# EAGLE design PwrGenBrd_v4.2 (EAGLE 7.6.0)

## Sheet 1 of 2
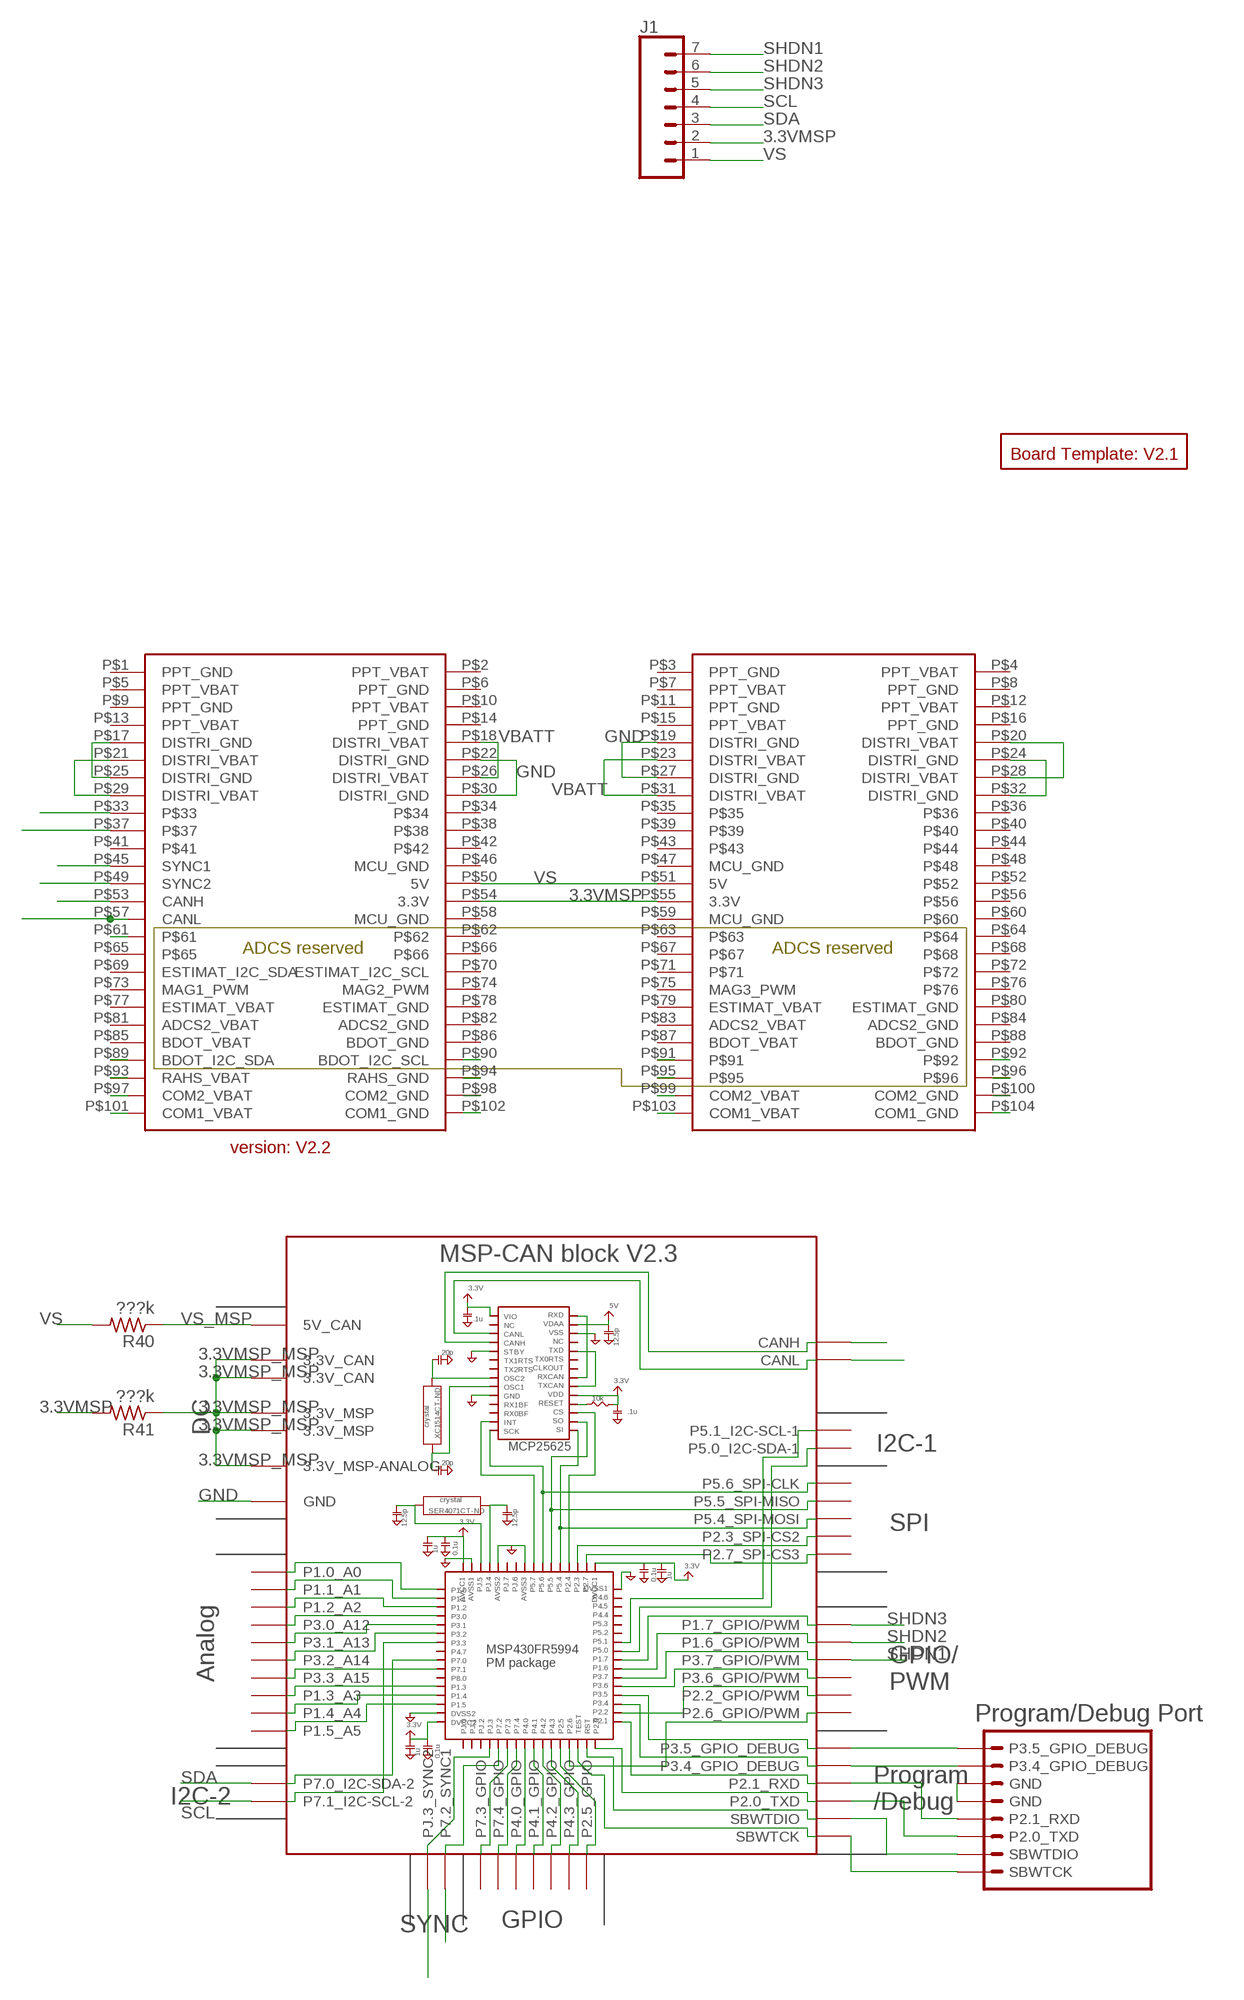
[diagram p0: schematic, sheet 1, part 1 of 2]
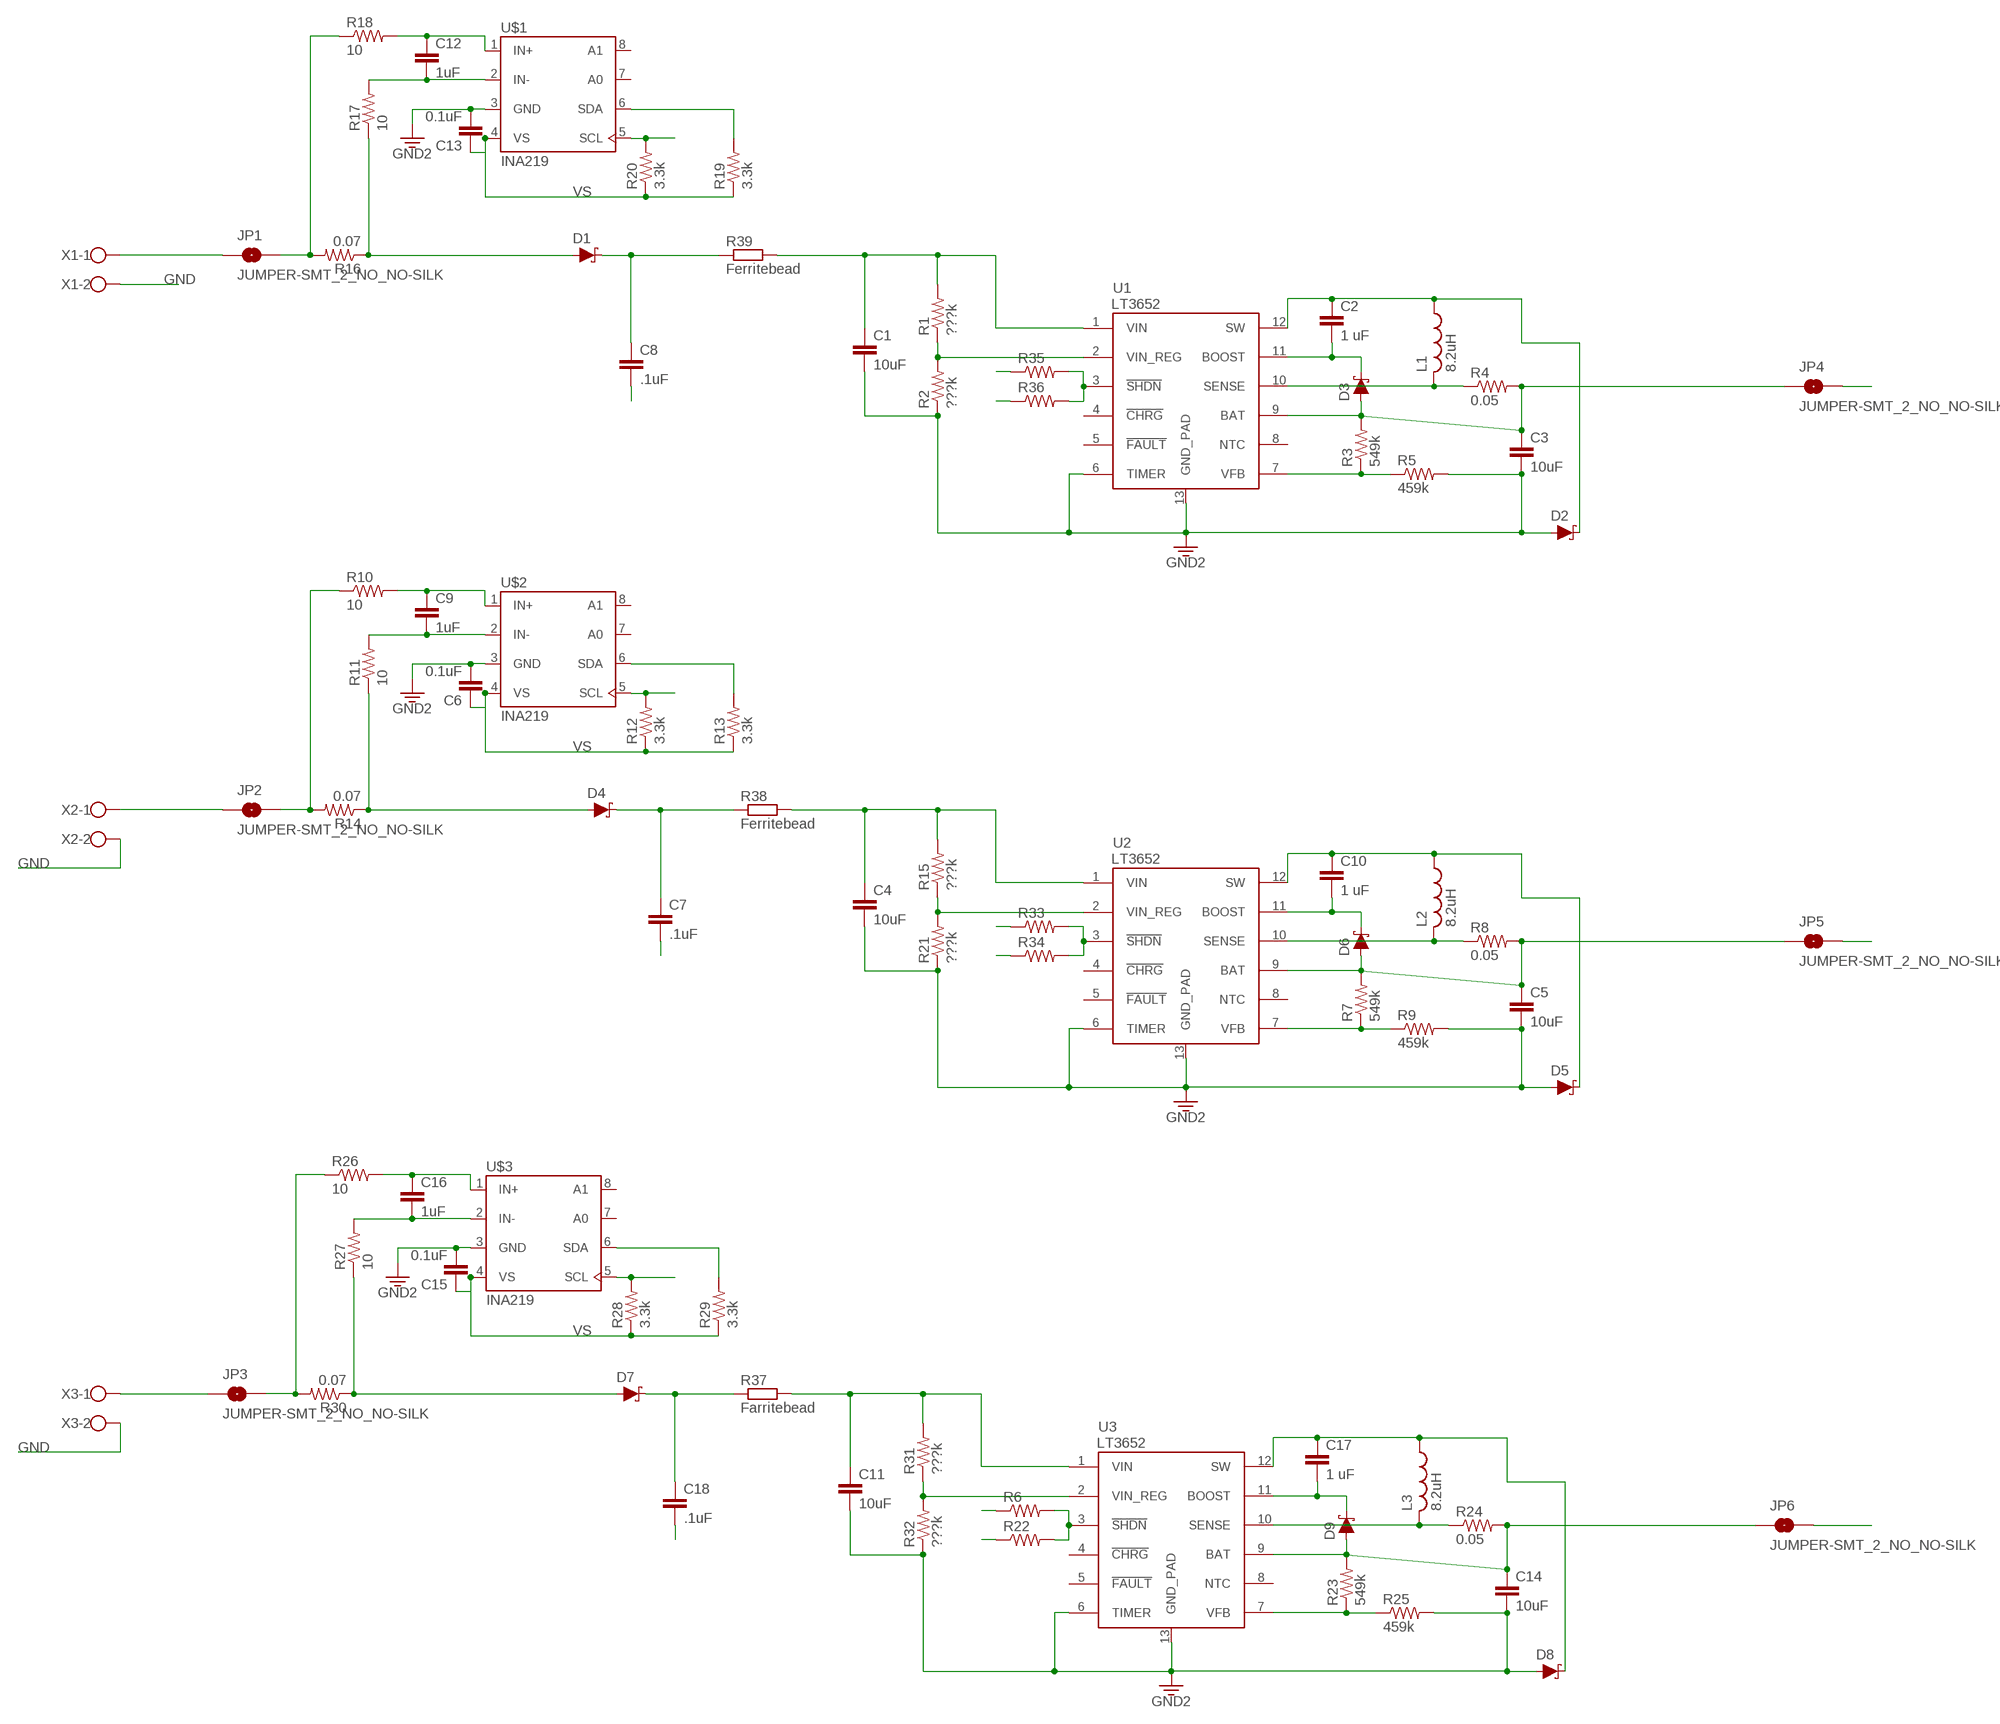
[diagram p1: schematic, sheet 1, part 2 of 2]

### Parts
C1  10uF  10UF-1210-50V-20%  [1210]
C2  1 uF  C-EUC0805  [C0805]
C3  10uF  C-EUC0805  [C0805]
C4  10uF  10UF-1210-50V-20%  [1210]
C5  10uF  C-EUC0805  [C0805]
C6  0.1uF  C-EUC0805  [C0805]
C7  .1uF  C-EUC0805  [C0805]
C8  .1uF  C-EUC0805  [C0805]
C9  1uF  C-EUC0805  [C0805]
C10  1 uF  C-EUC0805  [C0805]
C11  10uF  10UF-1210-50V-20%  [1210]
C12  1uF  C-EUC0805  [C0805]
C13  0.1uF  C-EUC0805  [C0805]
C14  10uF  C-EUC0805  [C0805]
C15  0.1uF  C-EUC0805  [C0805]
C16  1uF  C-EUC0805  [C0805]
C17  1 uF  C-EUC0805  [C0805]
C18  .1uF  C-EUC0805  [C0805]
D1  DIODE-SCHOTTKY-B340A  [SMA-DIODE]
D2  DIODE-SCHOTTKY-B340A  [SMA-DIODE]
D3  DIODE-SCHOTTKY-ZLLS500  [SOT23-3]
D4  DIODE-SCHOTTKY-B340A  [SMA-DIODE]
D5  DIODE-SCHOTTKY-B340A  [SMA-DIODE]
D6  DIODE-SCHOTTKY-ZLLS500  [SOT23-3]
D7  DIODE-SCHOTTKY-B340A  [SMA-DIODE]
D8  DIODE-SCHOTTKY-B340A  [SMA-DIODE]
D9  DIODE-SCHOTTKY-ZLLS500  [SOT23-3]
J1  CONN_07LOCK_LONGPADS  [1X07_LOCK_LONGPADS]
JP1  JUMPER-SMT_2_NO_NO-SILK  [SMT-JUMPER_2_NO_NO-SILK]
JP2  JUMPER-SMT_2_NO_NO-SILK  [SMT-JUMPER_2_NO_NO-SILK]
JP3  JUMPER-SMT_2_NO_NO-SILK  [SMT-JUMPER_2_NO_NO-SILK]
JP4  JUMPER-SMT_2_NO_NO-SILK  [SMT-JUMPER_2_NO_NO-SILK]
JP5  JUMPER-SMT_2_NO_NO-SILK  [SMT-JUMPER_2_NO_NO-SILK]
JP6  JUMPER-SMT_2_NO_NO-SILK  [SMT-JUMPER_2_NO_NO-SILK]
L1  8.2uH  L-USL1812  [L1812]
L2  8.2uH  L-USL1812  [L1812]
L3  8.2uH  L-USL1812  [L1812]
R1  ???k  R-US_R0805  [R0805]
R2  ???k  R-US_R0805  [R0805]
R3  549k  R-US_R0805  [R0805]
R4  0.05  R-US_R0805  [R0805]
R5  459k  R-US_R0805  [R0805]
R6  R-US_R0805  [R0805]
R7  549k  R-US_R0805  [R0805]
R8  0.05  R-US_R0805  [R0805]
R9  459k  R-US_R0805  [R0805]
R10  10  R-US_R0805  [R0805]
R11  10  R-US_R0805  [R0805]
R12  3.3k  R-US_R0805  [R0805]
R13  3.3k  R-US_R0805  [R0805]
R14  0.07  R-US_R0805  [R0805]
R15  ???k  R-US_R0805  [R0805]
R16  0.07  R-US_R0805  [R0805]
R17  10  R-US_R0805  [R0805]
R18  10  R-US_R0805  [R0805]
R19  3.3k  R-US_R0805  [R0805]
R20  3.3k  R-US_R0805  [R0805]
R21  ???k  R-US_R0805  [R0805]
R22  R-US_R0805  [R0805]
R23  549k  R-US_R0805  [R0805]
R24  0.05  R-US_R0805  [R0805]
R25  459k  R-US_R0805  [R0805]
R26  10  R-US_R0805  [R0805]
R27  10  R-US_R0805  [R0805]
R28  3.3k  R-US_R0805  [R0805]
R29  3.3k  R-US_R0805  [R0805]
R30  0.07  R-US_R0805  [R0805]
R31  ???k  R-US_R0805  [R0805]
R32  ???k  R-US_R0805  [R0805]
R33  R-US_R0805  [R0805]
R34  R-US_R0805  [R0805]
R35  R-US_R0805  [R0805]
R36  R-US_R0805  [R0805]
R37  Farritebead  R-EU_R1206  [R1206]
R38  Ferritebead  R-EU_R1206  [R1206]
R39  Ferritebead  R-EU_R1206  [R1206]
R40  ???k  R-US_R0805  [R0805]
R41  ???k  R-US_R0805  [R0805]
U1  LT3652  [MSOP-12_GND]
U2  LT3652  [MSOP-12_GND]
U3  LT3652  [MSOP-12_GND]
U$1  INA219  [SO08]
U$2  INA219  [SO08]
U$3  INA219  [SO08]
U$4  PC104_CONNECTOR  [PC104_CONNECTOR]
U$5  MSP-CAN_BLOCK  [MSP-CAN_BLOCK]
U$6  BOARD_TEMPLATE_(V2.1)  [BOARD_TEMPLATE_(V2.1)]
U$8  PROGRAM/DEBUG_PORT  [1X08_CONNECTOR]
X1  W237-102  [W237-102]
X2  W237-102  [W237-102]
X3  W237-102  [W237-102]

### Nets
3.3VMSP: J1.2 R41.2 U$4.P$54(3.3V) U$4.P$55(3.3V)
3.3VMSP_MSP: R41.1 U$5.3.3V@CAN1(3.3V_CAN) U$5.3.3V@CAN2(3.3V_CAN) U$5.3.3V@MSP1(3.3V_MSP) U$5.3.3V@MSP2(3.3V_MSP) U$5.3.3V_ANALOG@MSP2(3.3V_MSP-ANALOG)
BATT: C3.1 D3.1(A) JP4.1 R3.2 R4.2 U1.9(BAT)
BATT1: C5.1 D6.1(A) JP5.1 R7.2 R8.2 U2.9(BAT)
BATT2: C14.1 D9.1(A) JP6.1 R23.2 R24.2 U3.9(BAT)
BOOST: C2.2 D3.3(C) U1.11(BOOST)
BOOST1: C10.2 D6.3(C) U2.11(BOOST)
BOOST2: C17.2 D9.3(C) U3.11(BOOST)
CANH: U$4.P$53(CANH) U$5.CANH
CANL: U$4.P$57(CANL) U$5.CANL
GND: C1.2 C3.2 C4.2 C5.2 C6.2 C7.2 C8.2 C11.2 C13.2 C14.2 C15.2 C18.2 D2.A D5.A D8.A R2.1 R5.2 R9.2 R21.1 R25.2 R32.1 U1.6(TIMER) U1.13(GND_PAD) U2.6(TIMER) U2.13(GND_PAD) U3.6(TIMER) U3.13(GND_PAD) U$1.3(GND) U$2.3(GND) U$3.3(GND) U$4.P$17(DISTRI_GND) U$4.P$19(DISTRI_GND) U$4.P$22(DISTRI_GND) U$4.P$24(DISTRI_GND) U$4.P$25(DISTRI_GND) U$4.P$27(DISTRI_GND) U$4.P$30(DISTRI_GND) U$4.P$32(DISTRI_GND) U$5.GND@1(GND) U$5.GND@2(GND) U$5.GND@3(GND) U$5.GND@4(GND) U$5.GND@5(GND) U$5.GND@7(GND) U$5.GND@8(GND) U$5.GND@9(GND) U$5.GND@10(GND) U$5.GND@11(GND) U$5.GND@12(GND) U$5.GND@13(GND) U$5.GND@14(GND) U$5.GND@15(GND) U$5.GND@16(GND) U$5.GND@17(GND) U$5.GND@26(GND) U$8.5(GND) U$8.6(GND) X1.2 X2.2 X3.2 ; supply symbol labelled GND2
IN+: C12.1 R18.2 U$1.1(IN+)
IN+1: C9.1 R10.2 U$2.1(IN+)
IN+2: C16.1 R26.2 U$3.1(IN+)
IN++: JP1.2 R16.2 R18.1
IN++1: JP2.2 R10.1 R14.2
IN++2: JP3.2 R26.1 R30.2
IN-: C12.2 R17.2 U$1.2(IN-)
IN-1: C9.2 R11.2 U$2.2(IN-)
IN-2: C16.2 R27.2 U$3.2(IN-)
IN--: D1.A R16.1 R17.1
IN--1: D4.A R11.1 R14.1
IN--2: D7.A R27.1 R30.1
N$2: R6.2 R22.2 U3.3(!SHDN)
N$3: U$4.P$101(COM1_VBAT)
N$4: U$4.P$97(COM2_VBAT)
N$5: U$4.P$93(RAHS_VBAT)
N$6: U$4.P$89(BDOT_I2C_SDA)
N$8: U$4.P$61
N$9: U$4.P$90(BDOT_I2C_SCL)
N$10: U$4.P$98(COM2_GND)
N$11: U$4.P$103(COM1_VBAT)
N$12: U$4.P$102(COM1_GND)
N$13: U$4.P$94(RAHS_GND)
N$14: U$4.P$99(COM2_VBAT)
N$15: U$4.P$91
N$16: U$4.P$95
N$17: U$4.P$92
N$18: U$4.P$96
N$19: U$4.P$100(COM2_GND)
N$20: U$4.P$104(COM1_GND)
N$21: C8.1 D1.C R39.1
N$22: C7.1 D4.C R38.1
N$23: R33.2 R34.2 U2.3(!SHDN)
N$24: C18.1 D7.C R37.1
N$26: R35.2 R36.2 U1.3(!SHDN)
P2.0TXD: U$5.P2.0_TXD U$8.3(P2.0_TXD)
P2.1RXD: U$5.P2.1_RXD U$8.4(P2.1_RXD)
P3.4GPIO: U$5.P3.4_GPIO_DEBUG U$8.7(P3.4_GPIO_DEBUG)
P3.5GPIO: U$5.P3.5_GPIO_DEBUG U$8.8(P3.5_GPIO_DEBUG)
PNL1: JP1.1 R35.1 X1.1
PNL2: JP2.1 R33.1 X2.1
PNL3: JP3.1 R6.1 X3.1
SBWTCK: U$5.SBWTCK U$8.SBWTCK
SBWTDIO: U$5.SBWTDIO U$8.2(SBWTDIO)
SCL: J1.4 R12.2 R20.2 R28.2 U$1.5(SCL) U$2.5(SCL) U$3.5(SCL) U$4.P$33 U$5.P7.1_I2C-SCL-2
SDA: J1.3 R13.2 R19.2 R29.2 U$1.6(SDA) U$2.6(SDA) U$3.6(SDA) U$4.P$37 U$5.P7.0_I2C-SDA-2
SENSE: L1.2 R4.1 U1.10(SENSE)
SENSE1: L2.2 R8.1 U2.10(SENSE)
SENSE2: L3.2 R24.1 U3.10(SENSE)
SHDN1: J1.7 R36.1 U$5.P3.7_GPIO/PWM
SHDN2: J1.6 R34.1 U$5.P1.6_GPIO/PWM
SHDN3: J1.5 R22.1 U$5.P1.7_GPIO/PWM
SW: C2.1 D2.C L1.1 U1.12(SW)
SW1: C10.1 D5.C L2.1 U2.12(SW)
SW2: C17.1 D8.C L3.1 U3.12(SW)
SYNC1: U$4.P$45(SYNC1) U$5.P7.2_SYNC1
SYNC2: U$4.P$49(SYNC2) U$5.PJ.3_SYNC2
VBATT: JP4.2 JP5.2 JP6.2 U$4.P$18(DISTRI_VBAT) U$4.P$20(DISTRI_VBAT) U$4.P$21(DISTRI_VBAT) U$4.P$23(DISTRI_VBAT) U$4.P$26(DISTRI_VBAT) U$4.P$28(DISTRI_VBAT) U$4.P$29(DISTRI_VBAT) U$4.P$31(DISTRI_VBAT)
VFB: R3.1 R5.1 U1.7(VFB)
VFB1: R7.1 R9.1 U2.7(VFB)
VFB2: R23.1 R25.1 U3.7(VFB)
VIN: C1.1 R1.2 R39.2 U1.1(VIN)
VIN1: C4.1 R15.2 R38.2 U2.1(VIN)
VIN2: C11.1 R31.2 R37.2 U3.1(VIN)
VIN_REG: R1.1 R2.2 U1.2(VIN_REG)
VIN_REG1: R15.1 R21.2 U2.2(VIN_REG)
VIN_REG2: R31.1 R32.2 U3.2(VIN_REG)
VS: C6.1 C13.1 C15.1 J1.1 R12.1 R13.1 R19.1 R20.1 R28.1 R29.1 R40.2 U$1.4(VS) U$2.4(VS) U$3.4(VS) U$4.P$50(5V) U$4.P$51(5V)
VS_MSP: R40.1 U$5.5V(5V_CAN)
Unconnected: U1.4(!CHRG) U1.5(!FAULT) U1.8(NTC) U2.4(!CHRG) U2.5(!FAULT) U2.8(NTC) U3.4(!CHRG) U3.5(!FAULT) U3.8(NTC) U$1.7(A0) U$1.8(A1) U$2.7(A0) U$2.8(A1) U$3.7(A0) U$3.8(A1) U$4.P$1(PPT_GND) U$4.P$2(PPT_VBAT) U$4.P$3(PPT_GND) U$4.P$4(PPT_VBAT) U$4.P$5(PPT_VBAT) U$4.P$6(PPT_GND) U$4.P$7(PPT_VBAT) U$4.P$8(PPT_GND) U$4.P$9(PPT_GND) U$4.P$10(PPT_VBAT) U$4.P$11(PPT_GND) U$4.P$12(PPT_VBAT) U$4.P$13(PPT_VBAT) U$4.P$14(PPT_GND) U$4.P$15(PPT_VBAT) U$4.P$16(PPT_GND) U$4.P$34 U$4.P$35 U$4.P$36 U$4.P$38 U$4.P$39 U$4.P$40 U$4.P$41 U$4.P$42 U$4.P$43 U$4.P$44 U$4.P$46(MCU_GND) U$4.P$47(MCU_GND) U$4.P$48 U$4.P$52 U$4.P$56 U$4.P$58(MCU_GND) U$4.P$59(MCU_GND) U$4.P$60 U$4.P$62 U$4.P$63 U$4.P$64 U$4.P$65 U$4.P$66 U$4.P$67 U$4.P$68 U$4.P$69(ESTIMAT_I2C_SDA) U$4.P$70(ESTIMAT_I2C_SCL) U$4.P$71 U$4.P$72 U$4.P$73(MAG1_PWM) U$4.P$74(MAG2_PWM) U$4.P$75(MAG3_PWM) U$4.P$76 U$4.P$77(ESTIMAT_VBAT) U$4.P$78(ESTIMAT_GND) U$4.P$79(ESTIMAT_VBAT) U$4.P$80(ESTIMAT_GND) U$4.P$81(ADCS2_VBAT) U$4.P$82(ADCS2_GND) U$4.P$83(ADCS2_VBAT) U$4.P$84(ADCS2_GND) U$4.P$85(BDOT_VBAT) U$4.P$86(BDOT_GND) U$4.P$87(BDOT_VBAT) U$4.P$88(BDOT_GND) U$5.P1.0_A0 U$5.P1.1_A1 U$5.P1.2_A2 U$5.P1.3_A3 U$5.P1.4_A4 U$5.P1.5_A5 U$5.P2.2_GPIO/PWM U$5.P2.4_SPI-CS2(P2.3_SPI-CS2) U$5.P2.5_GPIO U$5.P2.6_GPIO/PWM U$5.P2.7_SPI-CS3 U$5.P3.0_A12 U$5.P3.1_A13 U$5.P3.2_A14 U$5.P3.3_A15 U$5.P3.6_GPIO/PWM U$5.P4.0_GPIO U$5.P4.1_GPIO U$5.P4.2_GPIO U$5.P4.3_GPIO U$5.P5.0_I2C-SDA-1 U$5.P5.1_I2C-SCL-1 U$5.P5.4_SPI-MOSI U$5.P5.5_SPI-MISO U$5.P5.6_SPI-CLK U$5.P7.3_GPIO U$5.P7.4_GPIO

## Sheet 2 of 2

## Library data of the parts
C1 C4 C11 = SparkFun-Capacitors:10UF: 10.0µF ceramic capacitors A capacitor is a passive two-terminal electrical component used to store electrical energy temporarily in an electric field.; PROD_ID: CAP-09824
C2 C7 C8 C10 C17 C18 = rcl:C-EU: CAPACITOR, European symbol
C3 C5 C6 C9 C12-C16 = resistor:C-EU: CAPACITOR, European symbol
D1 D2 D4 D5 D7 D8 = SparkFun-DiscreteSemi:DIODE-SCHOTTKY: Schottky diode A Schottky diode is a semiconductor diode which has a low forward voltage drop and a very fast switching action.; PROD_ID: DIO-09886; VALUE: 3A/40V/500mV
D3 D6 D9 = SparkFun-DiscreteSemi:DIODE-SCHOTTKY: Schottky diode A Schottky diode is a semiconductor diode which has a low forward voltage drop and a very fast switching action.; PROD_ID: DIO-08411; VALUE: 700mA/40V/533mV
J1 = SparkFun-Connectors:CONN_07: Multi connection point. Often used as Generic Header-pin footprint for 0.1 inch spaced/style header connections On any of the 0.1 inch spaced packages, you can populate with these: Break Away Headers - Straight <https://www.sparkfun.com/products/116> (PRT-00116) Break Away Male Headers - Right Angle <https://www.sparkfun.com/products/553> (PRT-00553) Female Headers <https://www.sparkfun.com/products/115> (PRT-00115) Break Away Headers - Machine Pin <https://www.sparkfun.com/products/117> (PRT-00117) Break Away Female Headers - Swiss Machine Pin <https://www.sparkfun.com/products/743> (PRT-00743) For SCREWTERMINALS and SPRING TERMINALS visit here: Screw Terimnals on SparkFun.com <https://www.sparkfun.com/search/results?term=Screw+Terminals> (5mm/3.5mm/2.54mm spacing) This device is also useful as a general connection point to wire up your design to another part of your project. Our various solder wires solder well into these plated through hole pads. Hook-Up Wire - Assortment (Stranded, 22 AWG) <https://www.sparkfun.com/products/11375> (PRT-11375) Hook-Up Wire - Assortment (Solid Core, 22 AWG) <https://www.sparkfun.com/products/11367> (PRT-11367) View the entire wire category on our website here <https://www.sparkfun.com/categories/141> Special notes: Molex polarized connector foot print use with SKU : PRT-08231 with associated crimp pins and housings. 1MM SMD Version SKU: PRT-10208 NOTES ON THE VARIANTS LOCK and LOCK_LONGPADS... This footprint was designed to help hold the alignment of a through-hole component (i.e. 6-pin header) while soldering it into place. You may notice that each hole has been shifted either up or down by 0.005 of an inch from it's more standard position (which is a perfectly straight line). This slight alteration caused the pins (the squares in the middle) to touch the edges of the holes. Because they are alternating, it causes a "brace" to hold the component in place. 0.005 has proven to be the perfect amount of "off-center" position when using our standard breakaway headers. Although looks a little odd when you look at the bare footprint, once you have a header in there, the alteration is very hard to notice. Also,if you push a header all the way into place, it is covered up entirely on the bottom side.
JP1-JP6 = SparkFun-Jumpers:JUMPER-SMT_2_NO: Normally open jumper This jumper has two pads in close proximity to each other. Apply solder to close the connection. Round pads are easier to solder for beginners, but are a lot larger. SparkFun Product that uses the round pads: SparkFun EL Sequencer <https://www.sparkfun.com/products/12781>
L1-L3 = rcl:L-US: INDUCTOR, American symbol
R1-R36 R40 R41 = rcl:R-US_: RESISTOR, American symbol
R37-R39 = rcl:R-EU_: RESISTOR, European symbol
U1-U3 = SparkFun-IC-Power:LT3652: LT3652 MPPT Solar Charge Controller(IC-11822) 5V-32V smart charger for batteries up to 14.4V
U$1-U$3 = User-Submitted:INA219
U$4 = CubeSat(V2.4):PC104_CONNECTOR
U$5 = CubeSat(V2.4):MSP-CAN_BLOCK
U$6 = CubeSat(V2.2):BOARD_TEMPLATE_(V2.1)
U$8 = CubeSat(V2.4):PROGRAM/DEBUG_PORT
X1-X3 = con-wago-500:W237-102: WAGO SCREW CLAMP; MPN: 237-102; OC_FARNELL: unknown; OC_NEWARK: 70K9898

## Board
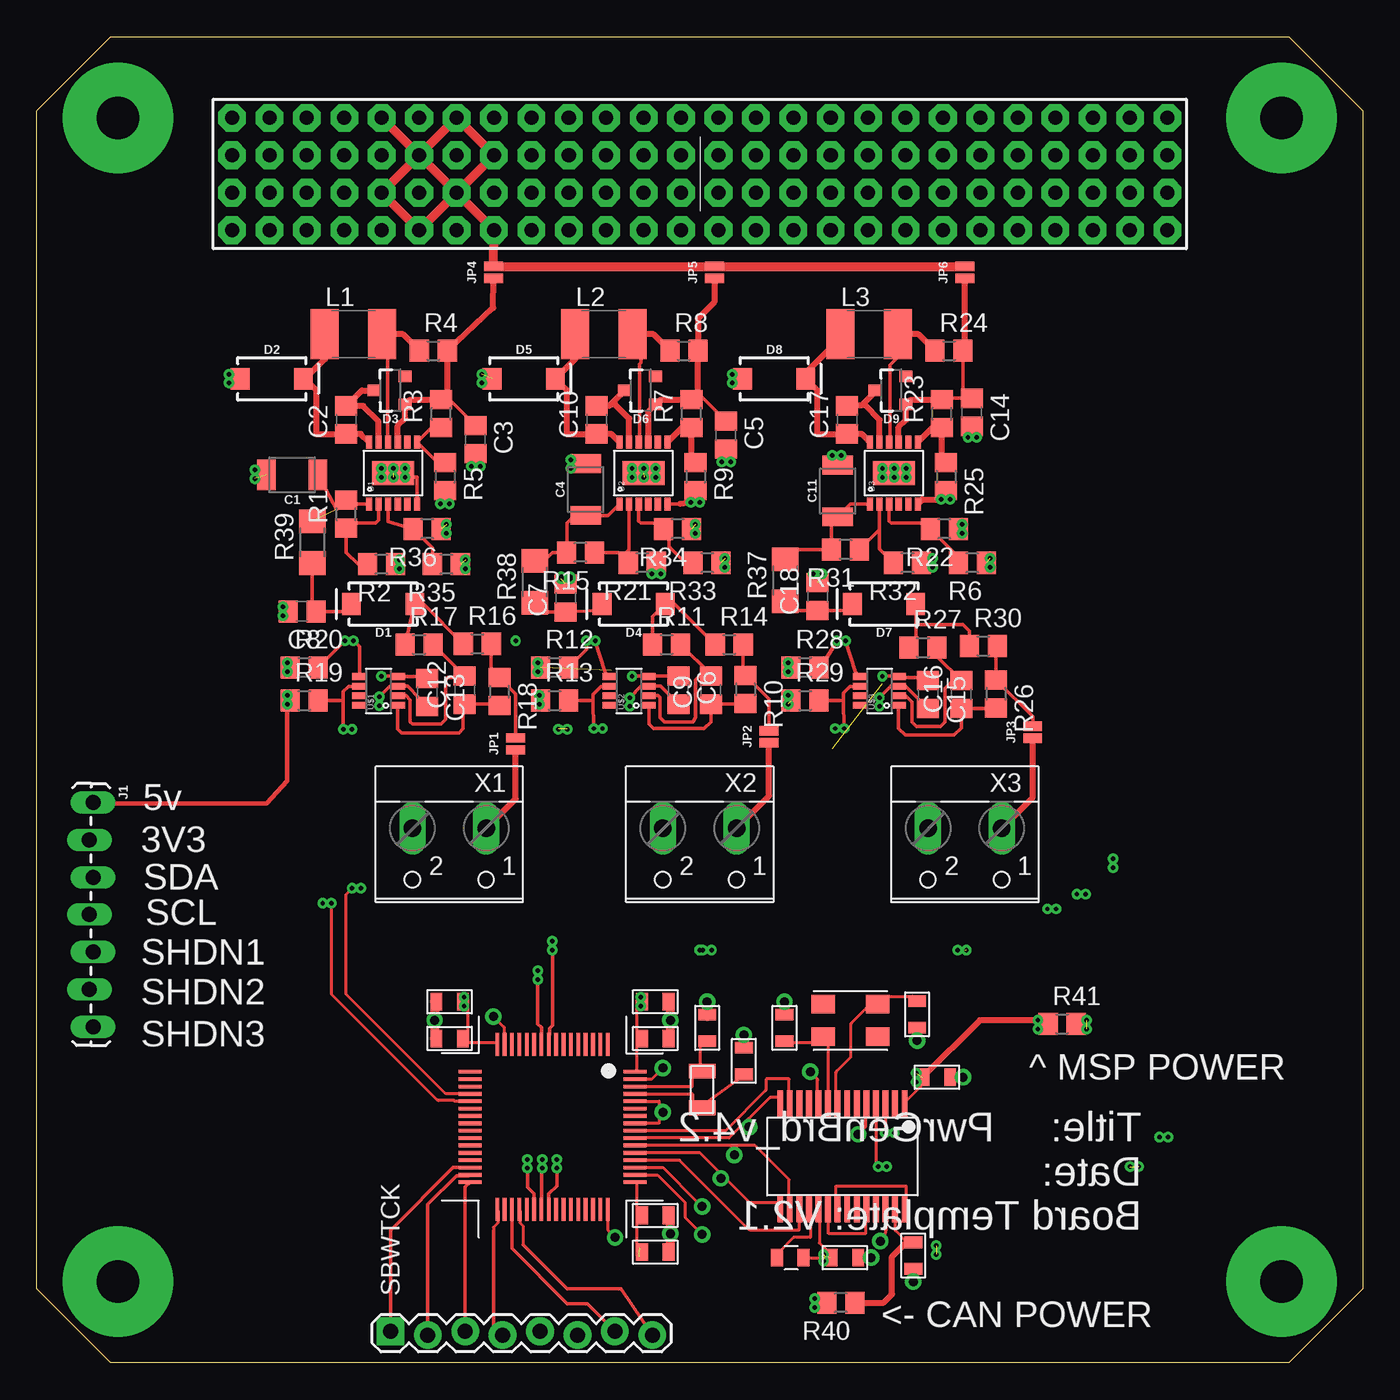
[diagram p2: board, top side]
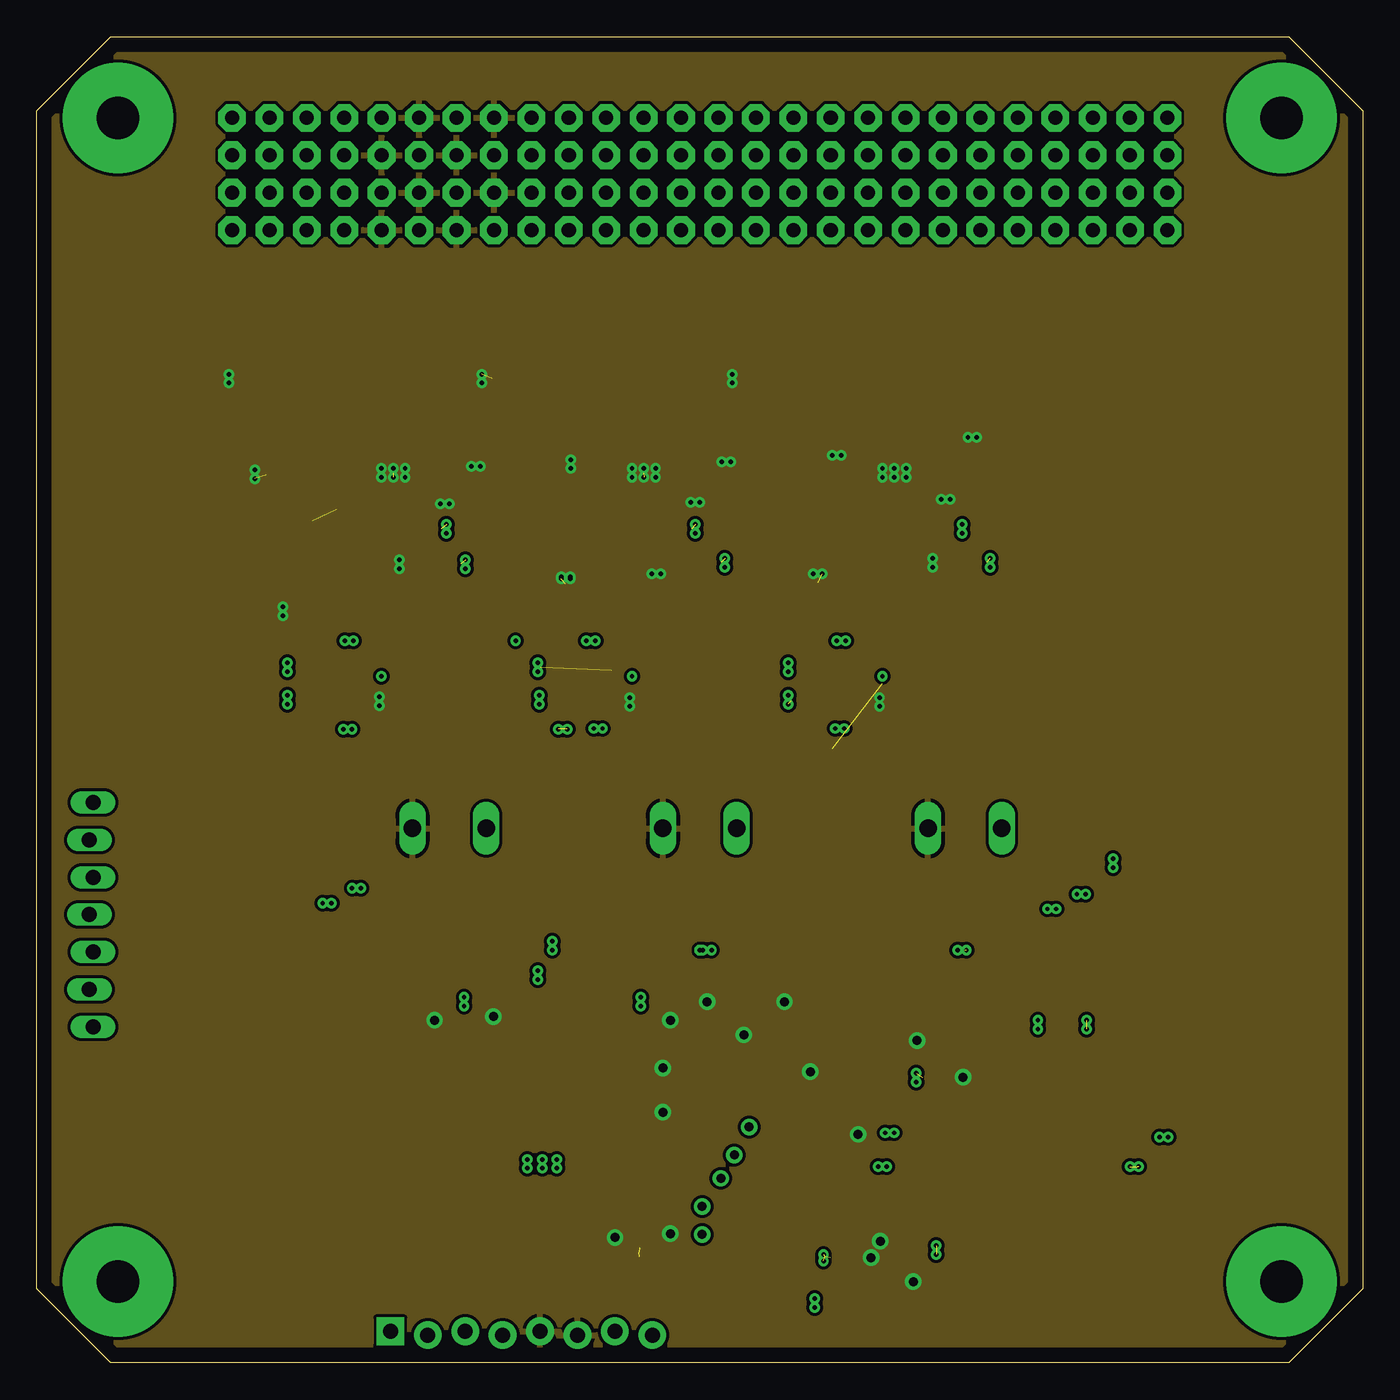
[diagram p3: board, inner layer GND]
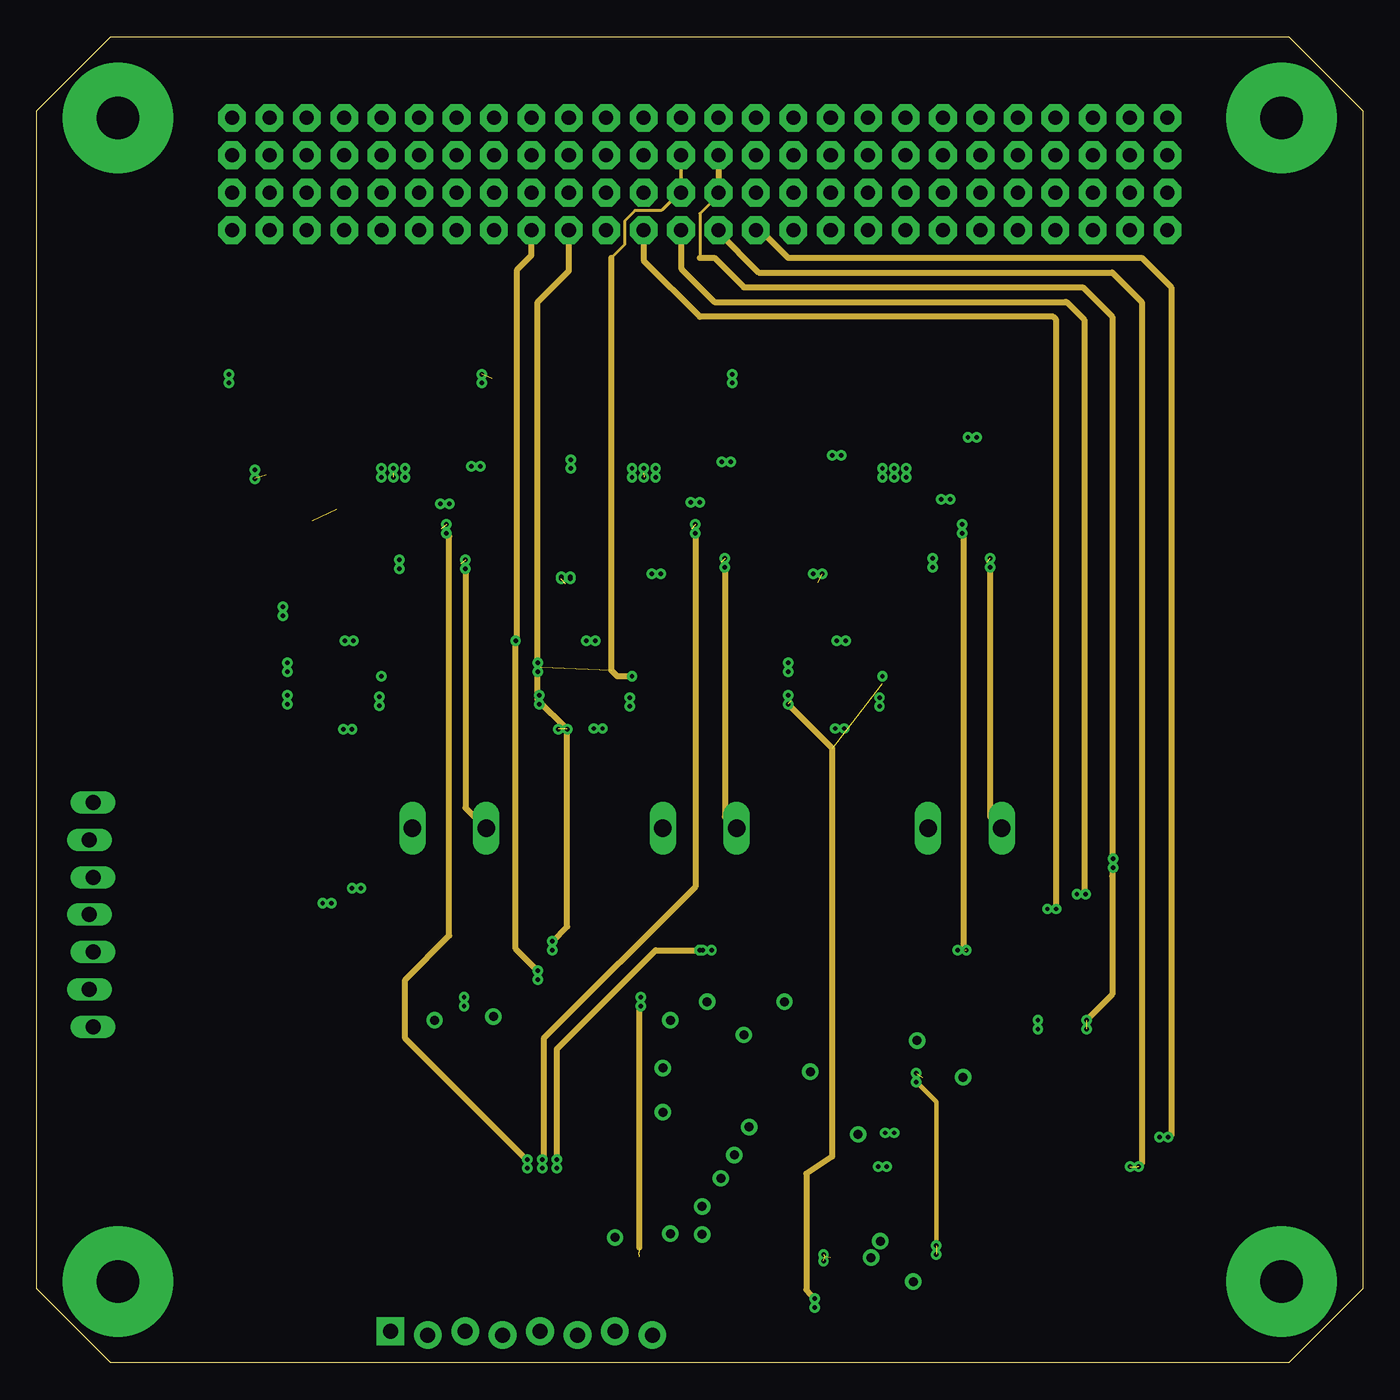
[diagram p4: board, inner layer TBD]
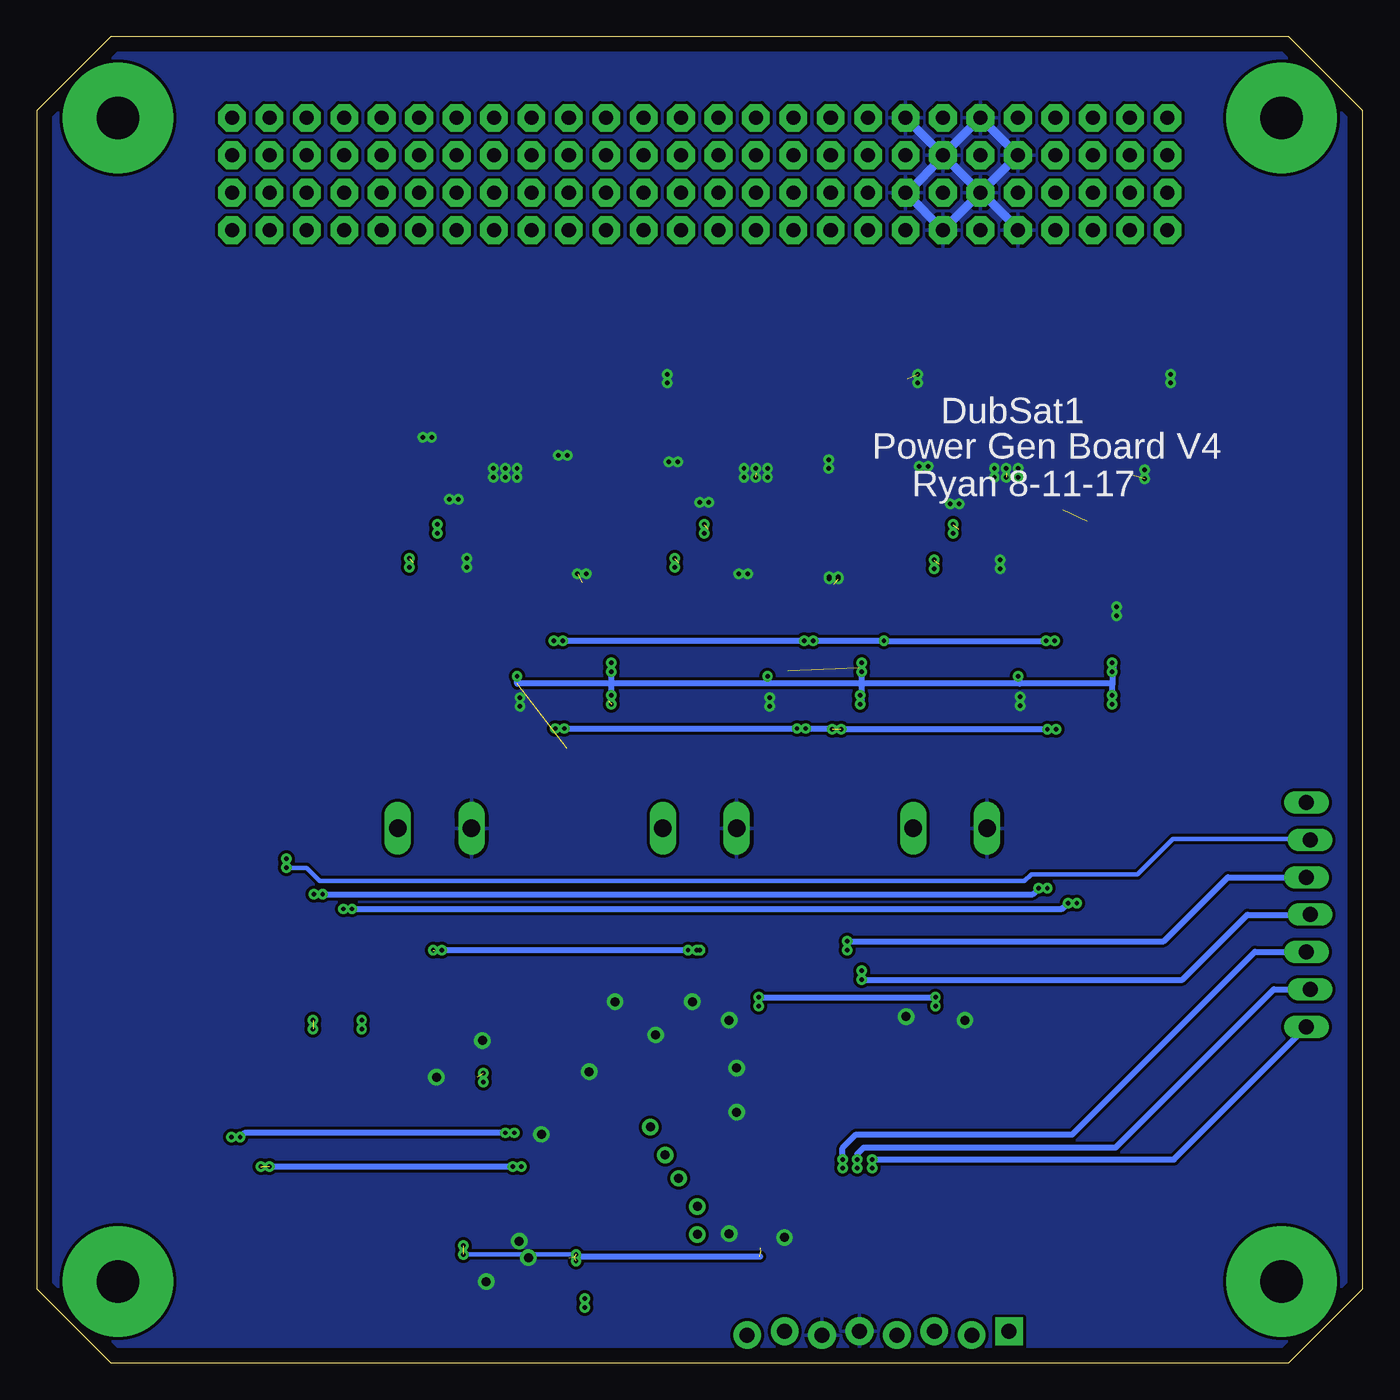
[diagram p5: board, bottom side, seen from below]

Size 90 x 90 mm. Coordinates in mm from the lower left corner, seen from the top.
Copper layers (1*2*3*16): Top 0.035mm / dielectric 1.5mm / GND 0.035mm / dielectric 0.15mm / TBD 0.035mm / dielectric 0.2mm / Bottom 0.035mm
Design rules "default *": minimum track width 10mil, minimum drill 24mil, track to track 8mil, track to pad 8mil, pad to pad 8mil, via to via 8mil, smd to smd 8mil, copper to edge 40mil, drill to drill 8mil, minimum pad ring 10mil, minimum via ring 8mil, stop-mask expansion 4mil, vias tented up to drill 0mil, thermal gap 10mil

### Footprints (pad centres in the part's own frame; a part is rotated, then mirrored left to right if it is on the bottom)
1210 = smd 1.27 x 2.06: 1 -1.755,0; 2 1.755,0
C0805 = smd 1.3 x 1.5: 1 -0.95,0; 2 0.95,0
SMA-DIODE = smd 1.27 x 1.47: A -2.15,0; C 2.15,0
SOT23-3 = smd 0.8 x 0.9: 1 -0.95,-1; 2 0.95,-1; 3 0,1.1
1X07_LOCK_LONGPADS = drill 1.016 long: 1 0,0.127; 2 2.54,-0.127; 3 5.08,0.127; 4 7.62,-0.127; 5 10.16,0.127; 6 12.7,-0.127; 7 15.24,0.127
SMT-JUMPER_2_NO_NO-SILK = smd 0.635 x 1.27: 1 -0.406,0; 2 0.406,0
L1812 = smd 1.9 x 3.4: 1 -1.95,0; 2 1.95,0
R0805 = smd 1.3 x 1.5: 1 -0.95,0; 2 0.95,0
R1206 = smd 1.6 x 1.803: 1 -1.422,0; 2 1.422,0
MSOP-12_GND = smd 0.889 x 0.42: 1 -2.1,1.625; 2 -2.1,0.975; 3 -2.1,0.325; 4 -2.1,-0.325; 5 -2.1,-0.975; 6 -2.1,-1.625; 7 2.1,-1.625; 8 2.1,-0.975; 9 2.1,-0.325; 10 2.1,0.325; 11 2.1,0.975; 12 2.1,1.625 | smd 1.651 x 2.845: 13 0,0
SO08 = smd 0.45 x 1: 1 -0.975,-1.3; 2 -0.325,-1.3; 3 0.325,-1.3; 4 0.975,-1.3; 5 0.975,1.3; 6 0.325,1.3; 7 -0.325,1.3; 8 -0.975,1.3
PC104_CONNECTOR = drill 0.953 pad 1.88 octagon: P$1 -31.75,31.88; P$2 -31.75,34.42; P$3 -31.75,36.96; P$4 -31.75,39.5; P$5 -29.21,31.88; P$6 -29.21,34.42; P$7 -29.21,36.96; P$8 -29.21,39.5; P$9 -26.67,31.88; P$10 -26.67,34.42; P$11 -26.67,36.96; P$12 -26.67,39.5; P$13 -24.13,31.88; P$14 -24.13,34.42; P$15 -24.13,36.96; P$16 -24.13,39.5; P$17 -21.59,31.88; P$18 -21.59,34.42; P$19 -21.59,36.96; P$20 -21.59,39.5; P$21 -19.05,31.88; P$22 -19.05,34.42; P$23 -19.05,36.96; P$24 -19.05,39.5; P$25 -16.51,31.88; P$26 -16.51,34.42; P$27 -16.51,36.96; P$28 -16.51,39.5; P$29 -13.97,31.88; P$30 -13.97,34.42; P$31 -13.97,36.96; P$32 -13.97,39.5; P$33 -11.43,31.88; P$34 -11.43,34.42; P$35 -11.43,36.96; P$36 -11.43,39.5; P$37 -8.89,31.88; P$38 -8.89,34.42; P$39 -8.89,36.96; P$40 -8.89,39.5; P$41 -6.35,31.88; P$42 -6.35,34.42; P$43 -6.35,36.96; P$44 -6.35,39.5; P$45 -3.81,31.88; P$46 -3.81,34.42; P$47 -3.81,36.96; P$48 -3.81,39.5; P$49 -1.27,31.88; P$50 -1.27,34.42; P$51 -1.27,36.96; P$52 -1.27,39.5; P$53 1.27,31.88; P$54 1.27,34.42; P$55 1.27,36.96; P$56 1.27,39.5; P$57 3.81,31.88; P$58 3.81,34.42; P$59 3.81,36.96; P$60 3.81,39.5; P$61 6.35,31.88; P$62 6.35,34.42; P$63 6.35,36.96; P$64 6.35,39.5; P$65 8.89,31.88; P$66 8.89,34.42; P$67 8.89,36.96; P$68 8.89,39.5; P$69 11.43,31.88; P$70 11.43,34.42; P$71 11.43,36.96; P$72 11.43,39.5; P$73 13.97,31.88; P$74 13.97,34.42; P$75 13.97,36.96; P$76 13.97,39.5; P$77 16.51,31.88; P$78 16.51,34.42; P$79 16.51,36.96; P$80 16.51,39.5; P$81 19.05,31.88; P$82 19.05,34.42; P$83 19.05,36.96; P$84 19.05,39.5; P$85 21.59,31.88; P$86 21.59,34.42; P$87 21.59,36.96; P$88 21.59,39.5; P$89 24.13,31.88; P$90 24.13,34.42; P$91 24.13,36.96; P$92 24.13,39.5; P$93 26.67,31.88; P$94 26.67,34.42; P$95 26.67,36.96; P$96 26.67,39.5; P$97 29.21,31.88; P$98 29.21,34.42; P$99 29.21,36.96; P$100 29.21,39.5; P$101 31.75,31.88; P$102 31.75,34.42; P$103 31.75,36.96; P$104 31.75,39.5
MSP-CAN_BLOCK = smd 1.2 x 0.8: 1 -6,6.08; 2 -6,7.88; 3 -8.5,6.08; 4 -8.5,7.88; 9 -8.5,-6.08; 10 -8.5,-7.88; 11 -6,-6.08; 12 -6,-7.88; 13 8.5,6.08; 14 8.5,7.88; 15 6,6.08; 16 6,7.88; 23 8.875,18.955; 24 8.875,20.755; 25 8.875,17.045; 26 8.875,15.245; 27 -3.375,25.205; 28 -3.375,27.005 | smd 1 x 0.25: 3.3V@CAN1 -3.375,25.125; 3.3V@CAN2 8.875,18.875; 3.3V@MSP1 8.501,5.884; 3.3V@MSP2 -8.533,-5.962; 3.3V_ANALOG@MSP2 -8.482,5.904 | smd 0.8 x 1.2: 5 -5.83,10.5; 6 -7.63,10.5; 7 -3.58,13; 8 -5.38,13; 17 -8.545,24.75; 18 -6.745,24.75; 19 -5.83,15.75; 20 -7.63,15.75; 21 7.83,24.5; 22 9.63,24.5 | smd 0.25 x 1: 5V 7.65,24.5 | smd 1.75 x 0.4: CANH -1.6,21.96; CANL -1.6,22.61; P$65 -1.6,23.91; P$66 -1.6,23.26; P$69 -1.6,21.31; P$70 -1.6,20.66; P$71 -1.6,20.01; P$72 -1.6,19.36; P$73 -1.6,18.71; P$74 -1.6,18.06; P$75 -1.6,17.41; P$76 -1.6,16.76; P$77 -1.6,16.11; P$78 -1.6,15.46; P$79 5.6,15.46; P$80 5.6,16.11; P$81 5.6,16.76; P$82 5.6,17.41; P$83 5.6,18.06; P$84 5.6,18.71; P$85 5.6,19.36; P$86 5.6,20.01; P$87 5.6,20.66; P$88 5.6,21.31; P$89 5.6,21.96; P$90 5.6,22.61; P$91 5.6,23.26; P$92 5.6,23.91 | drill 0.61: GND@1 -3.375,27.875; GND@2 -5.875,24.75; GND@3 -3.75,17.5; GND@4 0.5,20.75; GND@5 -8.5,15.75; GND@7 -8.5,10.5; GND@8 -7.25,8; GND@9 -4,7.5; GND@10 -1,7.5; GND@11 7.75,22.25; GND@12 10.5,24.5; GND@13 8.875,21.625; GND@14 7.25,8; GND@15 7.5,4.25; GND@16 -7.5,-4; GND@17 -7.25,-8; GND@26 -6.25,13; P2.4_SPI-CS2 5.397,10.16; P2.7_SPI-CS3 7.303,10.16; P5.4_SPI-MOSI 3.487,11.434; P5.5_SPI-MISO 1.9,12.354; P5.6_SPI-CLK 0,13.348 | smd 1.55 x 0.25: P1.0_A0 -5.6,3.75; P1.1_A1 -5.6,3.25; P1.2_A2 -5.6,2.75; P1.3_A3 -5.6,-1.75; P1.4_A4 -5.6,-2.25; P1.5_A5 -5.6,-2.75; P1.6_GPIO/PWM 5.6,-0.75; P1.7_GPIO/PWM 5.6,-0.25; P2.1_RXD 5.6,-3.75; P2.2_GPIO/PWM 5.6,-3.25; P3.0_A12 -5.6,2.25; P3.1_A13 -5.6,1.75; P3.2_A14 -5.6,1.25; P3.3_A15 -5.6,0.75; P3.4_GPIO_DEBUG 5.6,-2.75; P3.5_GPIO_DEBUG 5.6,-2.25; P3.6_GPIO/PWM 5.6,-1.75; P3.7_GPIO/PWM 5.6,-1.25; P5.0_I2C-SDA-1 5.6,0.25; P5.1_I2C-SCL-1 5.6,0.75; P7.0_I2C-SDA-2 -5.6,-0.25; P7.1_I2C-SCL-2 -5.6,-0.75; P$8 -5.6,0.25; P$11 -5.6,-1.25; P$15 -5.6,-3.25; P$16 -5.6,-3.75; P$43 5.6,1.25; P$44 5.6,1.75; P$45 5.6,2.25; P$46 5.6,2.75; P$47 5.6,3.25; P$48 5.6,3.75 | smd 0.25 x 1.55: P2.0_TXD 3.75,-5.6; P2.5_GPIO 1.75,-5.6; P2.6_GPIO/PWM 2.25,-5.6; P4.0_GPIO -0.25,-5.6; P4.1_GPIO 0.25,-5.6; P4.2_GPIO 0.75,-5.6; P4.3_GPIO 1.25,-5.6; P7.2_SYNC1 -1.75,-5.6; P7.3_GPIO -1.25,-5.6; P7.4_GPIO -0.75,-5.6; P$17 -3.75,-5.6; P$18 -3.25,-5.6; P$19 -2.75,-5.6; P$49 3.75,5.6; P$50 3.25,5.6; P$51 2.75,5.6; P$52 2.25,5.6; P$53 1.75,5.6; P$54 1.25,5.6; P$55 0.75,5.6; P$56 0.25,5.6; P$57 -0.25,5.6; P$58 -0.75,5.6; P$59 -1.25,5.6; P$60 -1.75,5.6; P$61 -2.25,5.6; P$62 -2.75,5.6; P$63 -3.25,5.6; P$64 -3.75,5.6; PJ.3_SYNC2 -2.25,-5.6; SBWTCK 2.75,-5.6; SBWTDIO 3.25,-5.6 | smd 1 x 1.8: P$93 -3.79,10.16; P$94 -1.29,10.16 | smd 1.25 x 1.6: P$104 -6.13,18.38; P$105 -6.13,22.08; P$106 -8.33,22.08; P$107 -8.33,18.38
BOARD_TEMPLATE_(V2.1) = drill 2.9 pad 7.5: P$1 -39.5,39.5; P$2 -39.5,-39.5; P$3 39.5,-39.5; P$4 39.5,39.5
1X08_CONNECTOR = drill 1.016 pad 1.88: 2 2.54,-0.127; 3 5.08,0.127; 4 7.62,-0.127; 5 10.16,0.127; 6 12.7,-0.127; 7 15.24,0.127; 8 17.78,-0.127 | drill 1.016 pad 1.88 square: SBWTCK 0,0.127
W237-102 = drill 1.194 long: 1 -2.5,-1.27; 2 2.5,-1.27

### Placement (x,y rotation side)
C1  17.33,60.26 180 top
C2  21,64 90 top
C3  29.77,62.66 270 top
C4  37.26,59.27 90 top
C5  46.77,62.96 270 top
C6  43.55,45.65 270 top
C7  35.9,51.9 90 top
C8  18,51 180 top
C9  45.75,45.65 90 top
C10  38,64 90 top
C11  54.36,59.17 90 top
C12  29.05,45.65 90 top
C13  26.5,45.5 270 top
C14  63.47,64.51 270 top
C15  60.5,45.35 270 top
C16  62.75,45.35 90 top
C17  55,64 90 top
C18  53,52 90 top
D1  23.51,51.5 180 top
D2  15.95,66.79 0 top
D3  24,66 90 top
D4  40.51,51.5 180 top
D5  33.05,66.79 0 top
D6  41,66 90 top
D7  57.51,51.5 180 top
D8  50.05,66.79 0 top
D9  58,66 90 top
J1  3.69,38.03 270 top
JP1  32.5,42 90 top
JP2  49.7,42.5 90 top
JP3  67.6,42.8 90 top
JP4  31,74 90 top
JP5  46,74 90 top
JP6  63,74 90 top
L1  21.49,69.81 0 top
L2  38.49,69.81 0 top
L3  56.49,69.81 0 top
R1  21,57.6 90 top
R2  23.4,54.2 180 top
R3  27.44,64.42 90 top
R4  26.92,68.69 0 top
R5  27.72,60.14 270 top
R6  63.5,54.3 180 top
R7  44.44,64.42 90 top
R8  43.92,68.69 0 top
R9  44.72,60.14 270 top
R10  48.1,45.7 270 top
R11  42.75,48.75 0 top
R12  35.15,47.2 0 top
R13  35.15,44.95 0 top
R14  47,48.75 0 top
R15  36.9,55 180 top
R16  29.9,48.8 0 top
R17  25.95,48.75 0 top
R18  31.4,45.55 270 top
R19  18.15,44.95 0 top
R20  18.15,47.2 0 top
R21  41.1,54.3 180 top
R22  61.6,56.6 180 top
R23  61.44,64.42 90 top
R24  61.92,68.69 0 top
R25  61.72,60.14 270 top
R26  65.1,45.4 270 top
R27  60.15,48.55 0 top
R28  52.15,47.2 0 top
R29  52.15,44.95 0 top
R30  64.25,48.65 0 top
R31  54.9,55.2 180 top
R32  59.1,54.3 180 top
R33  45.5,54.3 180 top
R34  43.5,56.6 180 top
R35  27.8,54.2 180 top
R36  26.5,56.6 180 top
R37  50.8,53.1 90 top
R38  33.8,53 90 top
R39  18.7,55.7 90 top
R40  54.58,4.07 180 top
R41  69.6,22.99 0 top
U1  24.18,60.39 90 top
U2  41.18,60.39 90 top
U3  58.18,60.39 90 top
U$1  23.2,45.6 90 top
U$2  40.2,45.6 90 top
U$3  57.2,45.6 90 top
U$4  45,45 0 top
U$5  35,16 270 top
U$6  45,45 0 top
U$8  24,2 0 top
X1  28,35 180 top
X2  45,35 180 top
X3  63,35 180 top

### Tracks (layer width: path | path; a pad name or v marks a point on that pad's centre or on a via)
3.3VMSP  (via drill 0.3)  (1 unrouted)
  Top 0.406: v71.25,23.25 70.8,23.25 R41.2
  TBD 0.2: U$4.P$54 46.27,79.27 45,78 45,75
  TBD 0.305: 73,33.02 73,33.55 v73.05,33.6
  TBD 0.406: U$4.P$55 U$4.P$54 | 45,75 46,75 48,73 71,73 73,71 73,33.02 73,25 v71.25,23.25
  Bottom 0.305: J1.2 3.62,35.55 12.9,35.55 15.3,33.15 22.5,33.15 22.95,32.7 70.8,32.7 71.7,33.6 v73.05,33.6 v73.05,34.2
  other vias: 71.25,22.65
3.3VMSP_MSP  (via drill 0.3)  (7 unrouted)
  Top 0.254: v41,24.2 40.9,24.3 U$5.3.3V_ANALOG@MSP2 41,24.58 v41,24.8 | v29,24.2 29.04,24.24 U$5.3.3V@MSP2 29.04,24.76 v29,24.8 | 53.9,6.8 53.88,6.83 U$5.3.3V@CAN2 | 40.9,7.48 U$5.3.3V@MSP1
  Top 0.305: v59.7,19.05 59.8,19.05 U$5.3.3V@CAN1
  Top 0.406: v67.95,23.25 64,23.25 U$5.3.3V@CAN1 | v67.95,23.25 v67.95,22.65 | R41.1 68.21,22.99 v67.95,23.25
  TBD 0.305: v61.05,7.35 61.05,17.7 v59.7,19.05
  TBD 0.406: 40.9,7.8 40.9,24.1 v41,24.2
  Bottom 0.305: v53.4,7.35 v61.05,7.35
  Bottom 0.406: 40.9,7.2 53.5,7.2 | v41,24.8 v29,24.8
  other vias: 53.4,6.9 59.7,19.65 61.05,7.95
BATT
  Top 0.254: 27.87,65.8 27.87,65.51 C3.1
  Top 0.406: JP4.1 30.98,71.6 R4.2 27.87,65.8 R3.2 25.32,65.37 D3.1 25,64.1 24.5,63.6 U1.9
BATT1
  Top 0.254: 44.87,65.8 44.88,65.8 C5.1
  Top 0.406: JP5.1 46,72 44.87,70.87 R8.2 44.87,65.8 R7.2 42.32,65.37 D6.1 41.51,64.56 U2.9
BATT2
  Top 0.254: R23.2 61.53,65.46 C14.1 62.87,66.06 R24.2
  Top 0.406: R24.2 63,68.82 JP6.1 | R23.2 59.32,65.37 D9.1 59,64 58.5,63.5 U3.9
BOOST
  Top 0.254: U1.11
  Top 0.406: D3.3 22.05,66 C2.2 22.15,64.95 23.2,63.9 U1.11
BOOST1
  Top 0.406: D6.3 38.95,65.05 | 38.95,65.05 38.85,64.95 C10.2 | U2.11 40.2,64.1 39.25,65.05 38.95,65.05
BOOST2
  Top 0.406: C17.2 55.05,65 56,65 | 56,65 56.9,65.9 D9.3 | U3.11 57.2,64 56.2,65 56,65
CANH  (via drill 0.3)  (2 unrouted)
  Top 0.2: U$5.CANH 56.96,13.44 v57.1,13.3
  Top 0.254: v57.1,13.3 v57.7,13.3
  TBD 0.406: U$4.P$53 46.27,76.73 49,74 73,74 75,72 75,13.5 v74.8,13.3
  Bottom 0.406: v57.7,13.3 74.7,13.3 74.8,13.2
  other vias: 74.2,13.3 74.2,13.3
CANL  (via drill 0.3)
  Top 0.2: U$5.CANL v57.61,15.61 v57.6,15.6
  Top 0.254: v57.6,15.6 v58.2,15.6 | v76.2,15.3 v76.8,15.3
  TBD 0.406: U$4.P$57 49.12,76.88 51,75 75,75 77,73 77,15.4 76.9,15.3 v76.8,15.3
  Bottom 0.406: v58.2,15.6 75.9,15.6 v76.2,15.3
GND  (via drill 0.3)  (6 unrouted)
  Top 0.254: 13.8,66.89 v13.05,67.1 D2.A | U2.6 43.69,58.29 | v41.75,53.55 v42.35,53.55 42.05,54.45 R21.1 42,54.25 42,54 | v47.2,66.5 47.9,66.6 D8.A | v36.25,61.3 37.02,61.02 C4.2 | v54.6,61.6 54.52,60.92 C11.2 | v35.6,53.35 v36.2,53.35 | v53.3,53.55 v52.7,53.55 | v16.7,51.3 v16.7,50.7 16.75,50.7 C8.2 | v24.6,54.5 24.6,54.45 R2.1 | C13.2 25.6,45.45 25.5,45.6 25.18,45.92 U$1.3 23.98,45.92 v23.25,45.2 | C6.2 42.33,45.92 U$2.3 41.02,45.92 v40.25,45.15 | C15.2 58.98,45.92 U$3.3 57.98,45.92 v57.2,45.15 | C14.2 63.47,63.07 v63.2,62.8 | C5.2 46.77,61.42 v46.5,61.15 | v24.2,60.1 25.8,60.1 U1.6 | C3.2 29.77,61.12 v29.5,60.85
  Top 0.406: v44.4,58.4 43.69,58.29 | v45,58.4 44.81,59.19 R9.2 | R25.2 62,58.91 v62,58.6 | U3.6 60.12,58.6 v61.4,58.6 | U3.13 58.49,60.7 v59,60.7 | R32.1 60.2,54.3 v60.8,54 | v27.4,58.3 27.4,58.87 R5.2
  Bottom 0.61: U$4.P$25 30.95,79.34 30.95,79.4 28.44,81.91 28.44,81.95 | U$4.P$22 U$4.P$27 31.06,84.53 31.06,84.56 | U$4.P$22 25.86,79.42 23.37,76.93 23.37,76.83 | U$4.P$22 28.46,76.91 28.57,76.91 | 28.59,76.91 28.57,76.91 | 28.57,76.91 28.39,77.09 28.39,77.15 | U$4.P$22 U$4.P$19 | U$4.P$19 23.32,81.97 | U$4.P$19 25.86,84.41 25.95,84.41 | U$4.P$24 28.28,82.17 28.28,82.07
  other vias: 54,61.6 57.4,60.1 57.4,60.1 57.4,60.7 57.4,60.7 59,60.1 59,60.1 58.2,60.1 58.2,60.1 58.2,60.7 58.2,60.7 47.2,67.1 30.2,66.5 30.2,67.1 36.25,60.7 42,60.1 42,60.1 42,60.7 42,60.7 41.2,60.1 41.2,60.1 41.2,60.7 41.2,60.7 40.4,60.1 40.4,60.1 40.4,60.7 40.4,60.7 24.6,53.9 24.6,53.9 25,60.1 25,60.1 25,60.7 25,60.7 28,58.3 23.4,60.1 23.4,60.1 23.4,60.7 23.4,60.7 24.2,60.7 24.2,60.7 14.8,60 14.8,60.6 13.05,66.5 60.8,54.6 36.2,53.2 35.6,53.2 23.25,44.6 40.25,44.55 57.2,44.55 63.8,62.8 47.2,67.1 47.1,61.15 30.1,60.85
  pour GND: 0,90 90,90 90,0 0,0
  pour Bottom: 0,0 90,0 90,90 0,90
IN+
  Top 0.254: R18.2 31.3,44.7 C12.1 28.95,44.6 28.95,43.05 28.65,42.75 24.75,42.75 24.5,43 U$1.1
IN+1
  Top 0.254: R10.2 48.05,44.7 C9.1 45.75,43.5 45.3,43.05 41.85,43.05 41.55,43.35 41.55,44.58 U$2.1
IN+2
  Top 0.254: R26.2 65.05,44.4 C16.1 62.75,43.1 62.25,42.6 58.95,42.6 58.5,43.05 U$3.1
IN++
  Top 0.254: JP1.2 32.5,45.4 R18.1 30.85,47.05 R16.2
IN++1
  Top 0.254: R10.1 48.15,46.9 | R14.2 47.95,46.8 R10.1 | JP2.2 49.7,45.05 R10.1
IN++2
  Top 0.254: R30.2 65.1,48.55 R26.1 67.6,43.85 JP3.2
IN-
  Top 0.254: R17.2 C12.2 28.95,46.5 27.9,46.5 27.75,46.35 27.75,43.65 27.45,43.35 25.5,43.35 25.35,43.5 25.35,45 25.07,45.27 U$1.2
IN-1
  Top 0.254: R11.2 45.75,46.7 C9.2 45.7,46.65 45,46.65 44.7,46.35 44.7,43.8 44.55,43.5 42.6,43.5 42.3,43.8 42.3,45.15 42.17,45.27 U$2.2
IN-2
  Top 0.254: R27.2 61.1,47.95 C16.2 62.65,46.2 62.1,46.2 61.65,45.75 61.65,43.5 61.35,43.2 59.7,43.2 59.4,43.5 59.4,44.85 58.98,45.27 U$3.2
IN--
  Top 0.254: R17.1 D1.A 26.25,51.5 R16.1
IN--1
  Top 0.254: R11.1 41.8,50.64 D4.A 43.3,51.5 R14.1
IN--2
  Top 0.254: R27.1 59.66,49.01 59.66,49.95 | 59.66,49.95 D7.A | R30.1 63.3,49.65 62.85,50.1 59.81,50.1 59.66,49.95
N$2
  Top 0.254: U3.3 57.86,57.14 58,57 60.25,57 R22.2 62.55,54.7 R6.2
N$21
  Top 0.254: D1.C 20.86,51 C8.1 18.7,51.25 R39.1
N$22
  Top 0.254: D4.C 37.91,51.05 C7.1 34.43,50.95 R38.1
N$23
  Top 0.254: U2.3 40.86,57.14 41,57 42.15,57 R34.2 42.9,56.25 42.9,55.4 44,54.3 R33.2
N$24
  Top 0.254: D7.C 54.91,51.05 C18.1 51.43,51.05 R37.1
N$26
  Top 0.254: U1.3 23.86,57.09 R36.2 26.85,55.3 R35.2
P2.0TXD
  Top 0.254: U$5.P2.0_TXD 29.08,11.93 U$8.3
P2.1RXD
  Top 0.2: U$5.P2.1_RXD 31.3,10.35 31.3,9.5 31,9.2 31,9
  Top 0.254: U$8.4 31,2.49 31,9
P3.4GPIO
  Top 0.254: U$8.7 37.37,4 36,4 32.25,7.75 U$5.P3.4_GPIO_DEBUG
P3.5GPIO
  Top 0.2: U$5.P3.5_GPIO_DEBUG 32.8,10.35 32.8,9.5 33,9.3 33,8
  Top 0.254: U$8.8 39.65,5 36,5 33,8
PNL1  (via drill 0.3)  (1 unrouted)
  Top 0.254: v29.1,54.5 v29.1,53.9
  Top 0.406: X1.1 32.5,38.27 JP1.1
  TBD 0.406: v29.1,53.9 29.1,37.67 X1.1
PNL2  (via drill 0.3)  (1 unrouted)
  Top 0.254: v46.7,54.6 v46.7,54
  Top 0.406: X2.1 49.7,38.47 JP2.1
  TBD 0.406: v46.7,54 46.7,37.07 X2.1
PNL3  (via drill 0.3)  (1 unrouted)
  Top 0.254: v64.7,54.6 v64.7,54
  Top 0.406: X3.1 67.6,38.37 JP3.1
  TBD 0.406: v64.7,54 64.7,37.07 X3.1
SBWTCK
  Top 0.254: U$8.SBWTCK 24,9 28.25,13.25 U$5.SBWTCK
SBWTDIO
  Top 0.254: U$5.SBWTDIO 29.35,12.7 28.5,12.7 26.54,10.74 U$8.2
SCL  (via drill 0.3)
  Top 0.254: R20.2 v20.9,49 v21.5,49 21.9,48.6 U$1.5 | U$2.5 38.58,46.9 v37.9,49 v37.3,49 37.3,48.4 R12.2 | U$3.5 55.58,46.9 v54.9,49 v54.3,49 53.4,47.5 R28.2 | U$5.P7.1_I2C-SCL-2 34.25,22.75 34,23 v34,26 v34,26.6
  TBD 0.406: v34,26.6 32.5,28.1 v32.5,49 32.6,49.1 32.6,74.2 33.57,75.17 U$4.P$33
  Bottom 0.406: v20.9,49 v32.5,49 v37.9,49 v54.3,49 | 20.8,49 v20.9,49 | v21.5,49 v20.9,49 | 54.8,49 v54.3,49 | v54.9,49 v54.3,49 | v34,26 12.23,26 7.82,30.41 J1.4
SDA  (via drill 0.3)  (1 unrouted)
  Top 0.2: U$5.P7.0_I2C-SDA-2 34.8,21.65 34.8,22.3
  Top 0.254: v21.4,43 v20.8,43 20.8,44.95 | 20.8,44.95 R19.2 | U$2.6 38.88,45.9 38.3,45.9 37.75,45.35 37.75,44.95 | v37.8,43.05 37.75,44.95 | 37.75,44.95 R13.2 | U$3.6 55.88,45.9 55.2,45.9 54.75,45.45 54.75,44.95 | 54.75,44.95 v54.8,43.05 v54.2,43.05 | 54.75,44.95 R29.2 | 34.8,22.3 34.8,22.7 35,22.9 v35,28 v35,28.6 | 20.8,44.95 20.8,45.55 21.15,45.9 21.88,45.9 U$1.6
  TBD 0.406: v35,28.6 36,29.6 v36,43 34,45 34,72 36.11,74.11 U$4.P$37
  Bottom 0.406: 37.8,43 v36,43 v21.4,43 v20.8,43 | 37.8,43 54.8,43 v54.8,43.05 v54.2,43.05 | 37.8,43 v37.8,43.05 v38.4,43.05 | v35,28.6 13.51,28.6 9.15,32.95 J1.3
  other vias: 35.4,43
SENSE
  Top 0.254: U1.10 23.8,62.55 23.8,69.2 24,69.4 24,69.81
  Top 0.406: R4.1 24.85,69.81 24,69.81 L1.2
SENSE1
  Top 0.254: U2.10 40.9,62.53 40.9,67.8 41,67.9 41,69.81
  Top 0.406: R8.1 41.85,69.81 41,69.81 L2.2
SENSE2
  Top 0.254: U3.10 57.9,62.53 57.9,67.7 59,68.8 59,69.81
  Top 0.406: R24.1 59.85,69.81 59,69.81 L3.2
SHDN1  (via drill 0.3)  (1 unrouted)
  Top 0.254: v27.8,56.9 v27.8,56.3 | v33.3,13.8 v33.3,13.2 33.3,11.9 33.75,11.45 U$5.P3.7_GPIO/PWM
  TBD 0.406: v27.8,56.3 28,56.1 28,29 25,26 25,22 33.2,13.8 v33.3,13.8
  Bottom 0.406: v33.3,13.8 12.81,13.8 J1.7
SHDN2  (via drill 0.3)  (1 unrouted)
  Top 0.254: v44.7,56.9 v44.7,56.3 | v34.3,13.8 v34.3,13.2 34.25,13.15 U$5.P1.6_GPIO/PWM
  TBD 0.406: v44.7,56.3 44.7,32.3 34.4,22 34.4,13.9 v34.3,13.8
  Bottom 0.406: v34.3,13.8 34.3,14.16 33.86,14.6 16.77,14.6 6.03,25.34 3.57,25.34 J1.6
SHDN3  (via drill 0.3)  (1 unrouted)
  Top 0.254: v62.8,56.3 v62.8,56.9 62.8,56.85 R22.1 | v35.3,13.8 v35.3,13.2 35.3,12 34.75,11.45 U$5.P1.7_GPIO/PWM | v45.2,28 v45.8,28 | v62.5,28 v63.1,28
  TBD 0.254: 62.9,56.25 62.85,56.25 v62.8,56.3
  TBD 0.406: v35.3,13.8 35.3,21.3 42,28 v45,28 v45.2,28 v45.8,28 | 62.9,56.25 62.9,28.1 63,28
  Bottom 0.406: v45,28 v62.5,28 | v35.3,13.8 35.3,14.58 34.39,15.49 19.71,15.49 7.31,27.9 3.84,27.9 J1.5
SW
  Top 0.254: C2.1 20.95,63
  Top 0.406: U1.12 22,63.05 C2.1 | 20.95,63 19,63 19,66 18.21,66.79 | 18.21,66.79 D2.C | 18.21,66.79 19.54,68.12 L1.1
SW1
  Top 0.406: U2.12 38.99,63.05 C10.1 37.95,63 36,63 36,66 D5.C 36.54,68.13 L2.1
SW2
  Top 0.254: 53,66 D8.C
  Top 0.406: L3.1 54.54,69.54 52,67 53,66 53,63 54.95,63 C17.1 55.99,63.05 U3.12
SYNC1  (via drill 0.3)
  Top 0.2: U$5.P7.2_SYNC1 28.42,17.75 arc-45 28.3,17.8 27.3,17.8 arc-45 27.13,17.87 20,25 v20,31.2
  Top 0.254: v20,31.2 v19.4,31.2 | v68.6,30.8 v69.2,30.8
  TBD 0.406: U$4.P$45 41.19,74.81 45,71 69,71 69.13,70.87 arc-45 69.2,70.69 v69.2,30.8
  Bottom 0.406: v68.6,30.8 20.5,30.8 arc-45 20.33,30.87 v20,31.2
SYNC2  (via drill 0.3)
  Top 0.2: U$5.PJ.3_SYNC2 27.75,18.25 21,25 21,31.8 v21.4,32.2
  Top 0.254: v70.6,31.8 v71.2,31.8 | v21.4,32.2 v22,32.2
  TBD 0.406: U$4.P$49 43.73,74.38 arc45 43.8,74.2 46,72 69.8,72 arc-45 69.97,71.93 71.1,70.8 71.1,32.01 arc45 71.17,31.83 v71.2,31.8
  Bottom 0.406: v70.6,31.8 22.4,31.8 v22,32.2
VBATT
  Top 0.61: JP6.2 JP5.2 JP4.2 U$4.P$29 U$4.P$26 | U$4.P$26 U$4.P$31 U$4.P$28 U$4.P$23 | U$4.P$23 U$4.P$18 | U$4.P$26 U$4.P$21 23.47,79.36 23.47,79.37 | U$4.P$23 U$4.P$20 | U$4.P$23 U$4.P$26 28.54,79.42
VFB
  Top 0.254: R3.1 26.79,63.47 U1.7 27.2,61.09 R5.1
VFB1
  Top 0.406: R9.1 44.44,61.37 R7.1 43.78,63.47 U2.7
VFB2
  Top 0.406: R25.1 61.44,61.37 R23.1 60.78,63.47 U3.7
VIN  (1 unrouted)
  Top 0.254: U1.1 21.26,58.29 R1.2 20.36,57.91 C1.1
VIN1
  Top 0.254: 36.48,57.52 C4.1 | R38.2 34.42,54.42 35,55 R15.2 36,55.05 36,57 36.52,57.52 C4.1 | C4.1 38.78,57.52 U2.1
VIN2
  Top 0.254: 54.59,57.41 C11.1 | R37.2 51.48,55.2 R31.2 53.95,57.01 C11.1 | U3.1 55.23,58.29 C11.1
VIN_REG
  Top 0.254: U1.2 23.2,57.91 23.2,57.9 23.2,57.2 23,57 21.35,57 R1.1 21,55 21.8,54.2 R2.2
VIN_REG1
  Top 0.254: R15.1 39.45,55 39.73,54.73 | 39.73,54.73 R21.2 | U2.2 40.2,55.2 39.73,54.73
VIN_REG2
  Top 0.254: U3.2 57.2,56.55 | 57.2,56.55 R31.1 | 57.2,56.55 57.2,55.24 R32.2
VS  (via drill 0.3)  (3 unrouted)
  Top 0.254: v17,45.3 17.2,45.1 R19.1 17.2,44.9 v17,44.7 | R20.1 17.2,47.1 v17,46.9 v17,47.5 | v34,47.5 v34,46.9 34.2,47.1 R12.1 | v34.1,45.3 34.2,45.2 R13.1 34.2,44.8 v34.1,44.7 | 51.2,44.9 R29.1 51.2,45.1 v51,45.3 | v51,46.9 51.2,47.1 R28.1 51.2,47.3 v51,47.5 51,47 | v23.4,46.6 24.48,46.6 U$1.4 26.38,46.58 C13.1 | v40.4,46.6 41.48,46.6 U$2.4 41.52,46.6 C6.1 | v57.4,46.6 58.48,46.6 U$3.4 58.58,46.5 60.3,46.5 C15.1
  Top 0.305: v17,44.7 17,39.5 15.6,37.95 3.9,37.95 J1.1
  Top 0.406: R40.2 53.63,4.35 v52.8,4.35
  TBD 0.2: 42.5,78.3 42.4,78.2 40.6,78.2 39.9,77.5 39.9,75.9 39,75
  TBD 0.254: 42.5,78.3 43.62,79.42 U$4.P$50 U$4.P$51
  TBD 0.406: v34.1,44.7 34,44.6 | v40.4,46.6 39.4,46.6 39,47 39,75 | v51,44.7 54,41.7 54,14 52.23,12.83 52.23,4.95 v52.8,4.35 v52.8,3.75
  Bottom 0.406: v17,47.5 arc60 17,47 17,46 | v17,44.7 v17,45.3 17,46 | v51,44.7 v51,46.9 v51,47.5 | v40.4,46.6 40.5,46.5 | 23.5,46.5 v23.4,46.6 23.3,46.6 23.3,46.1 | 17,46 17.1,46.1 23.3,46.1 | 23.3,46.1 34,46.1 | 34,46.1 57.4,46.1 v57.4,46.6 | v34.1,45.3 34,45.4 | 34,45.4 34,46.1 | 34,46.1 v34,46.9 v34,47.5 | v34.1,44.7 34,44.8 34,45.4
VS_MSP
  Top 0.406: R40.1 57.48,4.08 58.05,4.65 58.05,7.2 59.2,8.35 U$5.5V

### Text on the board
_tsilk: 5v | 3V3 | SDA | SCL | SHDN1 | SHDN2 | SHDN3 | ^ MSP POWER | <- CAN POWER
_bsilk: DubSat1 | Power Gen Board V4 | Ryan 8-11-17